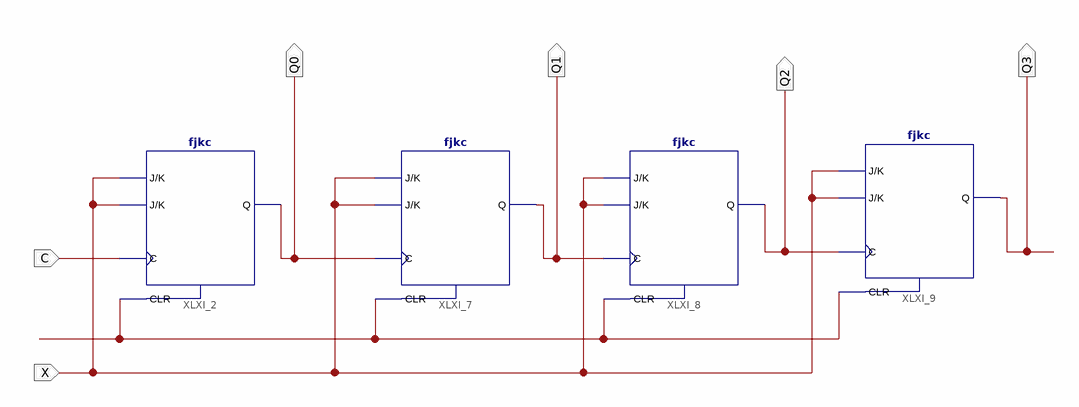
[diagram p0: schematic sheet 1]
// Xilinx ISE schematic Schem2.sch (virtex5) as structural Verilog: 4 symbols, 6 ports
module Schem2 (
  input  X,
  input  C,
  output Q0,
  output Q1,
  output Q2,
  output Q3
);

  wire XLXN_17;

  fjkc XLXI_2 (.C(C), .CLR(XLXN_17), .J(X), .K(X), .Q(Q0));
  fjkc XLXI_8 (.C(Q1), .CLR(XLXN_17), .J(X), .K(X), .Q(Q2));
  fjkc XLXI_9 (.C(Q2), .CLR(XLXN_17), .J(X), .K(X), .Q(Q3));
  fjkc XLXI_7 (.C(Q0), .CLR(XLXN_17), .J(X), .K(X), .Q(Q1));
endmodule
